# EAGLE design l293d (EAGLE 9.3.0)
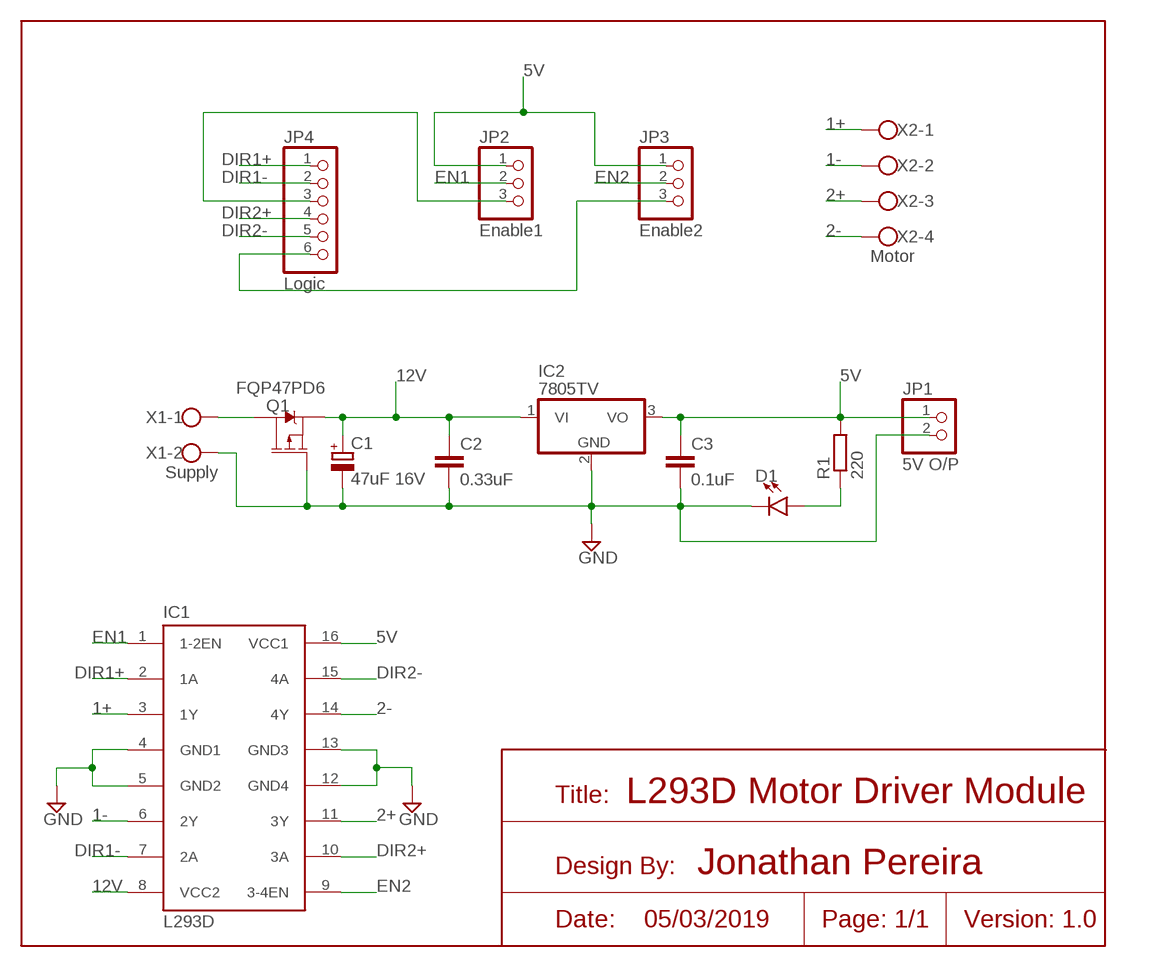
[diagram p0: schematic, sheet 1]

## Parts
C1  47uF 16V  CPOL-EUE2.5-5  [E2,5-5]
C2  0.33uF  C-EU025-024X044  [C025-024X044]
C3  0.1uF  C-EU025-024X044  [C025-024X044]
D1  LED5MM  [LED_5MM]
IC1  L293D  [DIL16]
IC2  7805TV  [TO220V]
JP1  5V O/P  PINHD-1X2  [1X02]
JP2  Enable1  PINHD-1X3  [1X03]
JP3  Enable2  PINHD-1X3  [1X03]
JP4  Logic  PINHD-1X6  [1X06]
Q1  FQP47PD6  MOSFET_PCH-NDP6020P  [TO220V]
R1  220  R-EU_0204/5  [0204/5]
X1  Supply  W237-102  [W237-102]
X2  Motor  W237-4  [W237-4]

## Nets
1+: IC1.3(1Y) X2.1
1-: IC1.6(2Y) X2.2
2+: IC1.11(3Y) X2.3
2-: IC1.14(4Y) X2.4
5V: C3.1 IC1.16(VCC1) IC2.3(VO) JP1.1 JP2.1 JP3.1 R1.2
12V: C1.+ C2.1 IC1.8(VCC2) IC2.1(VI) Q1.3(S)
DIR1+: IC1.2(1A) JP4.1
DIR1-: IC1.7(2A) JP4.2
DIR2+: IC1.10(3A) JP4.4
DIR2-: IC1.15(4A) JP4.5
EN1: IC1.1(1-2EN) JP2.2
EN2: IC1.9(3-4EN) JP3.2
GND: C1.- C2.2 C3.2 D1.K(C) IC1.4(GND1) IC1.5(GND2) IC1.12(GND4) IC1.13(GND3) IC2.2(GND) JP1.2 Q1.1(G) X1.2
N$3: D1.A R1.1
N$13: Q1.2(D) X1.1
N$14: JP2.3 JP4.3
N$16: JP3.3 JP4.6

## Notes on the sheet
- Title: | L293D Motor Driver Module
- Design By: | Jonathan Pereira
- Date: | 05/03/2019 | Page: 1/1 | Version: 1.0

## Library data of the parts
C1 = resistor:CPOL-EU: POLARIZED CAPACITOR, European symbol
C2 C3 = rcl:C-EU: CAPACITOR, European symbol; SPICEPREFIX: C
D1 = SparkFun-LED:LED: LED (Generic) Standard schematic elements and footprints for 5mm, 3mm, 1206, and 0603 sized LEDs. Generic LEDs with no color specified.
IC1 = st-microelectronics:L293D: PUSH-PULL 4 CHANNEL DRIVER; MPN: L293D; OC_FARNELL: 9589619; OC_NEWARK: 56P8249
IC2 = linear:78*: Positive VOLTAGE REGULATOR Source: http://cache.national.com/ds/LM/LM78L05.pdf http://www.fairchildsemi.com/ds/LM/LM7805.pdf
JP1 = pinhead:PINHD-1X2: PIN HEADER
JP2 JP3 = pinhead:PINHD-1X3: PIN HEADER
JP4 = pinhead:PINHD-1X6: PIN HEADER
Q1 = SparkFun-DiscreteSemi:MOSFET_PCH: P-channel MOSFETs Voltage controlled devices that allow control of high current outputs. SparkFun Products: SparkFun ESP32 Thing <https://www.sparkfun.com/products/13907> SparkFun ESP8266 Thing <https://www.sparkfun.com/products/13231>; PROD_ID: TRANS-13060; VALUE: 24A/20V/50mΩ
R1 = rcl:R-EU_: RESISTOR, European symbol; SPICEPREFIX: R
X1 = con-wago-500:W237-102: WAGO SCREW CLAMP; MPN: 237-102; OC_FARNELL: unknown; OC_NEWARK: 70K9898
X2 = con-wago-500:W237-4: WAGO SCREW CLAMP; OC_FARNELL: unknown; OC_NEWARK: unknown

## Board
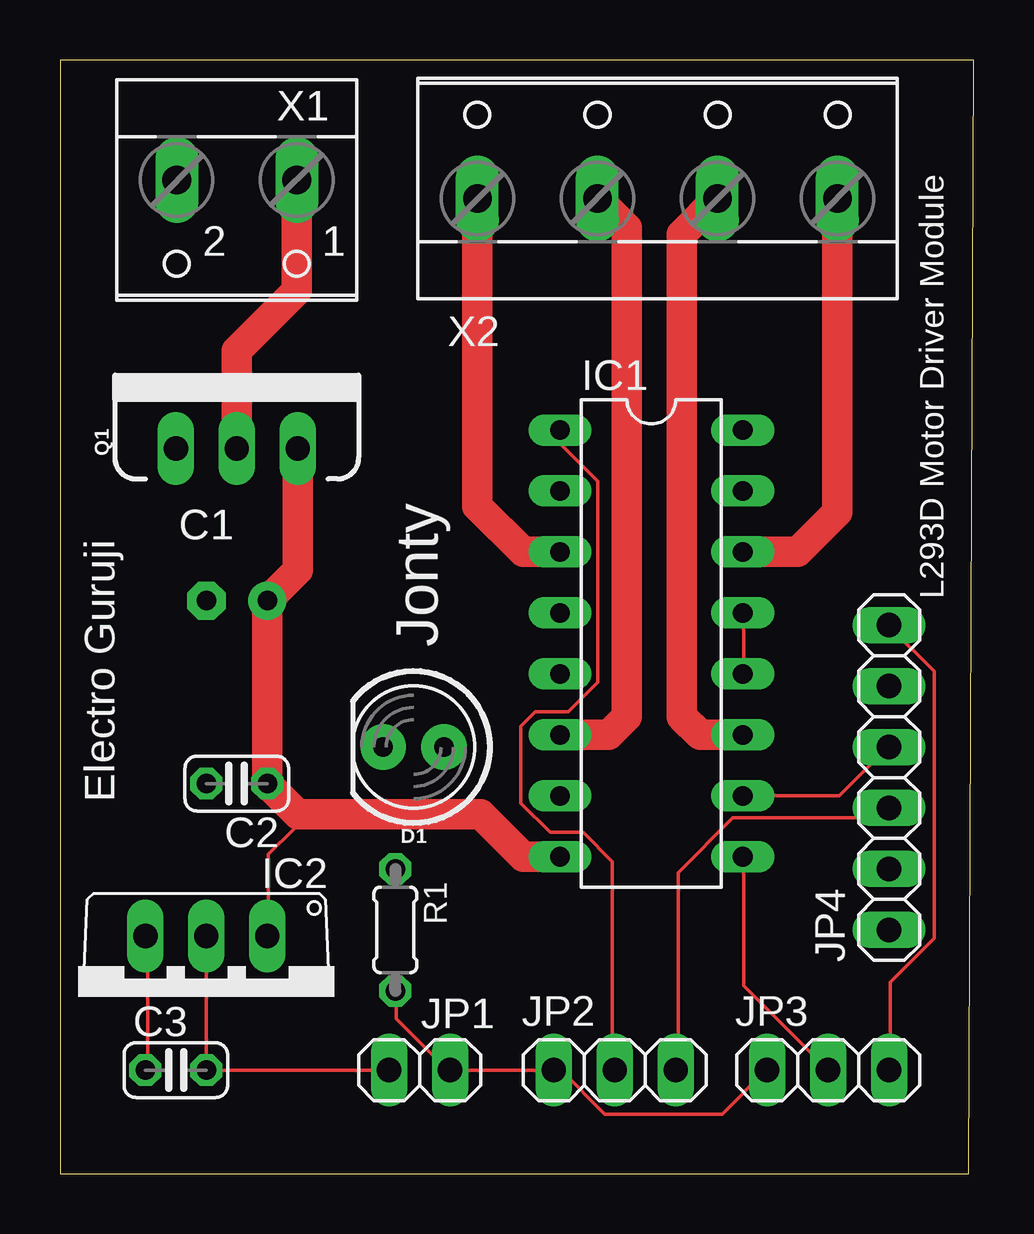
[diagram p1: board, top side]
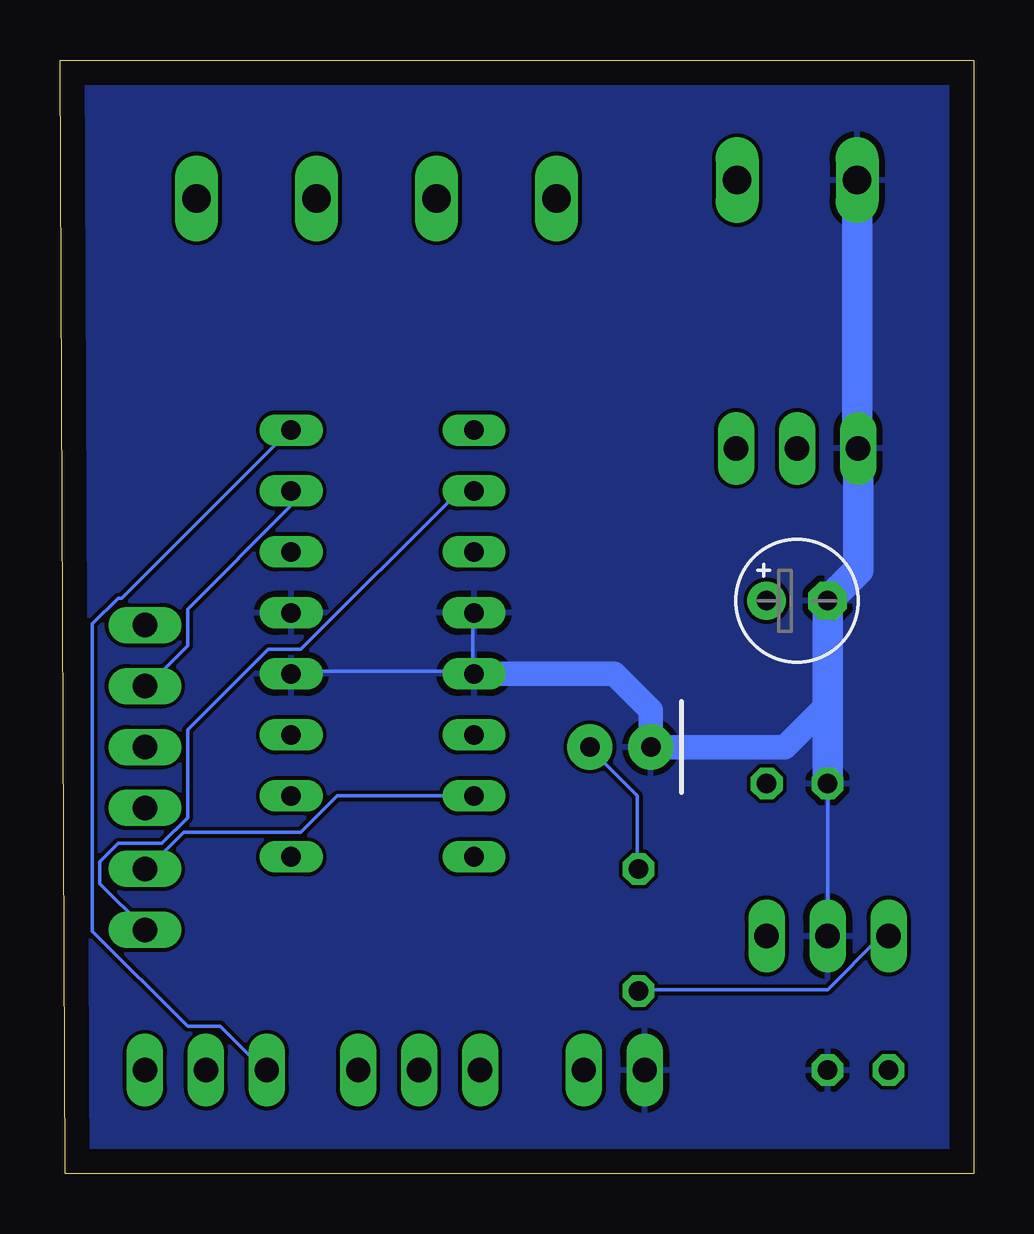
[diagram p2: board, bottom side, seen from below]

Size 38.08 x 46.41 mm. Coordinates in mm from the lower left corner, seen from the top.
Outline: 0,0 37.87,0 38.08,46.41 0,46.41 0,0
Copper layers (1*16): Top 0.035mm / dielectric 1.5mm / Bottom 0.035mm
Design rules "default": minimum track width 6mil, minimum drill 0.35mm, track to track 6mil, track to pad 6mil, pad to pad 6mil, via to via 6mil, smd to smd 6mil, copper to edge 40mil, drill to drill 6mil, minimum pad ring 10mil, minimum via ring 8mil, stop-mask expansion 4mil, vias tented up to drill 0mil, thermal gap 10mil

### Footprints (pad centres in the part's own frame; a part is rotated, then mirrored left to right if it is on the bottom)
E2,5-5 = drill 0.813 pad 1.6: + -1.27,0 | drill 0.813 pad 1.6 octagon: - 1.27,0
C025-024X044 = drill 0.813 octagon: 1 -1.27,0; 2 1.27,0
LED_5MM = drill 0.813 pad 1.88: A -1.27,0; K 1.27,0
DIL16 = drill 0.813 long: 1 -8.89,-3.81; 2 -6.35,-3.81; 3 -3.81,-3.81; 4 -1.27,-3.81; 5 1.27,-3.81; 6 3.81,-3.81; 7 6.35,-3.81; 8 8.89,-3.81; 9 8.89,3.81; 10 6.35,3.81; 11 3.81,3.81; 12 1.27,3.81; 13 -1.27,3.81; 14 -3.81,3.81; 15 -6.35,3.81; 16 -8.89,3.81
TO220V = drill 1.016 long: 1 -2.54,-2.54; 2 0,-2.54; 3 2.54,-2.54
1X02 = drill 1.016 long: 1 -1.27,0; 2 1.27,0
1X03 = drill 1.016 long: 1 -2.54,0; 2 0,0; 3 2.54,0
1X06 = drill 1.016 long: 1 -6.35,0; 2 -3.81,0; 3 -1.27,0; 4 1.27,0; 5 3.81,0; 6 6.35,0
TO220V' = drill 1.016 long: 1 -2.54,0; 2 0,0; 3 2.54,0
0204/5 = drill 0.813 octagon: 1 -2.54,0; 2 2.54,0
W237-102 = drill 1.194 long: 1 -2.5,-1.27; 2 2.5,-1.27
W237-4 = drill 1.194 long: 1 -7.5,-1.27; 2 -2.5,-1.27; 3 2.5,-1.27; 4 7.5,-1.27

### Placement (x,y rotation side)
C1  7.37,23.88 0 bottom
C2  7.37,16.26 180 top
C3  4.83,4.32 0 top
D1  14.73,17.78 180 top
IC1  24.64,22.1 270 top
IC2  6.1,7.37 180 top
JP1  14.99,4.32 180 top
JP2  23.11,4.32 0 top
JP3  32,4.32 0 top
JP4  34.54,16.51 90 top
Q1  FQP47PD6  [TO220V']  7.37,30.23 0 top
R1  13.97,10.16 270 top
X1  7.37,40.13 180 top
X2  24.89,41.91 0 top

### Tracks (layer width: path | path; a pad name or v marks a point on that pad's centre or on a via)
1+
  Top 1.27: X2.1 17.39,27.82 19.3,25.91 IC1.3
1-
  Top 1.27: X2.2 23.62,39.41 23.62,19.05 22.86,18.29 IC1.6
2+
  Top 1.27: X2.3 25.91,39.16 25.91,19.05 26.67,18.29 IC1.11
2-
  Top 1.27: X2.4 32.39,27.57 30.73,25.91 IC1.14 27.94,25.91
5V
  Top 0.152: C3.1 3.66,4.32 3.66,9.8 IC2.3 | R1.2 14.02,7.52 14.02,6.45 16.15,4.32 JP1.1 JP2.1 20.88,4.32 22.71,2.49 27.58,2.49 29.41,4.32 JP3.1
  Bottom 0.152: IC2.3 3.66,9.8 3.96,9.8 6.1,7.67 13.87,7.67 R1.2 | IC1.16 28.5,30.99 35.51,23.98 35.66,23.98 36.73,22.91 36.73,10.11 32.77,6.15 31.39,6.15 29.57,4.32 JP3.1
12V
  Top 0.152: IC2.1 8.69,9.96 8.69,13.31 9.75,14.38 9.91,14.99
  Top 1.27: Q1.3 9.91,25.15 C1.+ C2.1 9.91,14.99 17.53,14.99 19.3,13.21 IC1.8
DIR1+
  Bottom 0.152: IC1.2 20.88,28.4 21.49,28.4 28.04,21.84 29.41,21.84 32.77,18.49 32.77,14.83 33.83,13.77 35.66,13.77 36.42,13.01 36.42,12.09 34.59,10.26 JP4.1
DIR1-
  Bottom 0.152: IC1.7 26.52,15.75 28.04,14.22 32.92,14.22 34.44,12.7 JP4.2
DIR2+
  Top 0.152: IC1.10 32.46,15.75 34.44,17.73 JP4.4
DIR2-
  Bottom 0.152: IC1.15 28.5,28.4 28.5,27.79 32.77,23.52 32.77,22 34.44,20.32 JP4.5
EN1
  Top 0.152: IC1.1 20.88,30.99 20.88,30.38 22.4,28.85 22.4,20.47 21.18,19.25 19.81,19.25 19.2,18.64 19.2,15.44 20.42,14.22 21.79,14.22 23.01,13.01 23.01,4.32 JP2.2
EN2
  Top 0.152: JP3.2 28.5,7.82 28.5,13.16 IC1.9
GND
  Top 0.152: IC1.12 28.5,20.93 28.5,23.37 IC1.13 | IC2.2 C3.2 JP1.2
  Bottom 0.152: IC1.4 20.88,23.37 20.88,21.23 IC1.5 21.18,20.93 28.35,20.93 IC1.12 | IC2.2 C2.2
  Bottom 1.016: IC1.5 14.99,20.83 13.46,19.3 D1.K 7.87,17.78 6.1,19.56
  Bottom 1.27: X1.2 4.87,30.27 Q1.1 4.83,25.15 C1.- 6.1,19.56 C2.2
  pour Bottom: 0.25,46.23 0.25,0.25 37.59,0.25 37.59,45.97 0.51,45.97
N$3
  Bottom 0.152: R1.1 14.02,12.7 14.02,15.75 16,17.73 D1.A
N$13
  Top 1.27: X1.1 9.87,36.79 7.37,34.29 Q1.2
N$14
  Top 0.152: JP4.3 34.14,14.83 28.04,14.83 25.76,12.55 25.76,4.32 JP2.3
N$16
  Top 0.152: JP3.3 34.59,4.32 34.59,7.98 36.42,9.8 36.42,20.93 34.59,22.76 JP4.6

### Text on the board
tNames: L293D Motor Driver Module | Jonty | Electro Guruji